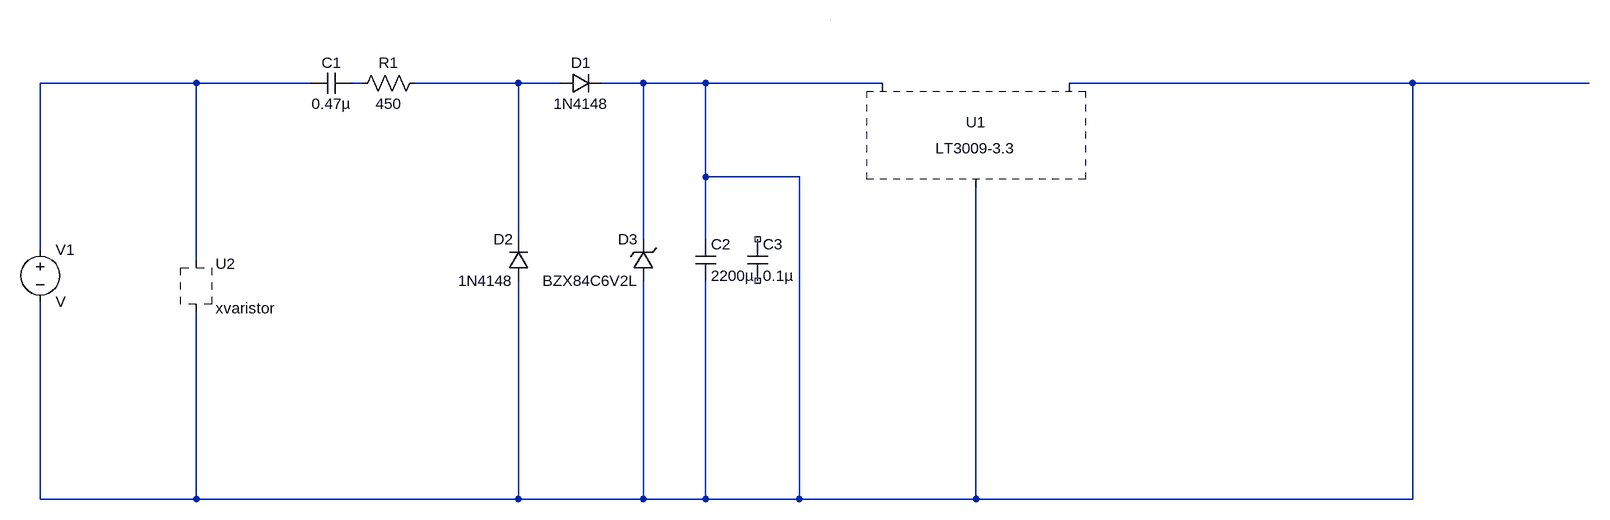
[diagram p0: schematic Draft1.asc]
Draft1.asc, the LTspice schematic file:
Version 4
SHEET 1 1172 744
WIRE -976 96 -1216 96
WIRE -800 96 -976 96
WIRE -720 96 -736 96
WIRE -480 96 -640 96
WIRE -416 96 -480 96
WIRE -288 96 -352 96
WIRE -192 96 -288 96
WIRE 80 96 -192 96
WIRE 896 96 368 96
WIRE 1168 96 896 96
WIRE -192 240 -192 96
WIRE -48 240 -192 240
WIRE -480 336 -480 96
WIRE -288 336 -288 96
WIRE -192 336 -192 240
WIRE -1216 352 -1216 96
WIRE -976 368 -976 96
WIRE -1216 736 -1216 432
WIRE -976 736 -976 448
WIRE -976 736 -1216 736
WIRE -480 736 -480 400
WIRE -480 736 -976 736
WIRE -288 736 -288 400
WIRE -288 736 -480 736
WIRE -192 736 -192 400
WIRE -192 736 -288 736
WIRE -48 736 -48 240
WIRE -48 736 -192 736
WIRE 224 736 224 256
WIRE 224 736 -48 736
WIRE 896 736 896 96
WIRE 896 736 224 736
WIRE 0 0 0 0
SYMBOL PowerProducts\\LT3009-3.3 224 144 R0
SYMATTR InstName U1
SYMBOL diode -416 112 R270
WINDOW 0 32 32 VTop 2
WINDOW 3 0 32 VBottom 2
SYMATTR InstName D1
SYMATTR Value 1N4148
SYMBOL diode -464 400 R180
WINDOW 0 24 64 Left 2
WINDOW 3 24 0 Left 2
SYMATTR InstName D2
SYMATTR Value 1N4148
SYMBOL cap -736 80 R90
WINDOW 0 0 32 VBottom 2
WINDOW 3 32 32 VTop 2
SYMATTR InstName C1
SYMATTR Value 0.47µ
SYMBOL res -624 80 R90
WINDOW 0 0 56 VBottom 2
WINDOW 3 32 56 VTop 2
SYMATTR InstName R1
SYMATTR Value 450
SYMBOL zener -272 400 R180
WINDOW 0 24 64 Left 2
WINDOW 3 24 0 Left 2
SYMATTR InstName D3
SYMATTR Value BZX84C6V2L
SYMBOL cap -208 336 R0
SYMATTR InstName C2
SYMATTR Value 2200µ
SYMBOL cap -128 336 R0
SYMATTR InstName C3
SYMATTR Value 0.1µ
SYMBOL voltage -1216 336 R0
SYMATTR InstName V1
SYMBOL Misc\\xvaristor -992 352 R0
SYMATTR InstName U2

The netlist it stands for:
* Draft1.asc
* U1: LT3009-3.3 (symbol PowerProducts\LT3009-3.3 not available, pin order unknown); nets seen at it: N004
D1 N003 N004 1N4148
D2 N004 N003 1N4148
C1 N002 N001 0.47µ
R1 N003 N002 450
D3 N004 N004 BZX84C6V2L
C2 N004 N004 2200µ
C3 NC_01 NC_02 0.1µ
V1 N001 N004 V
* U2: xvaristor (symbol Misc\xvaristor not available, pin order unknown); nets seen at it: N001, N004
.model D D
.lib standard.dio
.backanno
.end